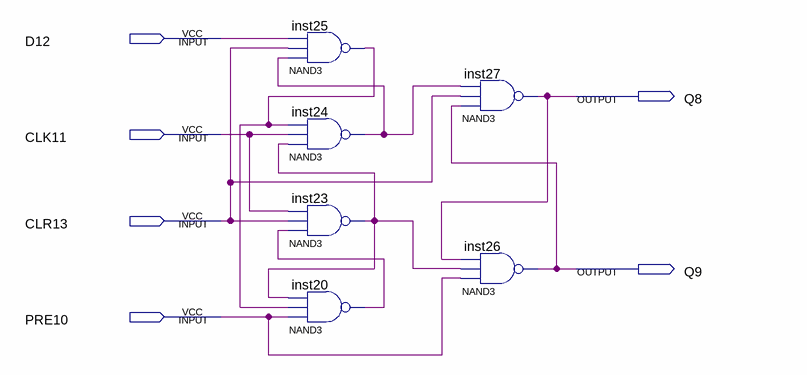
[diagram p0: schematic sheet]
// Quartus schematic 74LS74a_2.bdf as structural Verilog: 6 symbols, 6 pins
module \74LS74a_2  (
  input  D12,
  input  CLK11,
  input  CLR13,
  input  PRE10,
  output Q8,
  output Q9
);

  wire inst20_out, inst23_out, inst24_out, inst25_out;

  nand inst25 (inst25_out, inst24_out, CLR13, D12);
  nand inst24 (inst24_out, inst23_out, CLK11, inst25_out);
  nand inst23 (inst23_out, inst20_out, CLR13, CLK11);
  nand inst20 (inst20_out, PRE10, inst25_out, inst23_out);
  nand inst27 (Q8, Q9, CLR13, inst24_out);
  nand inst26 (Q9, PRE10, inst23_out, Q8);
endmodule
